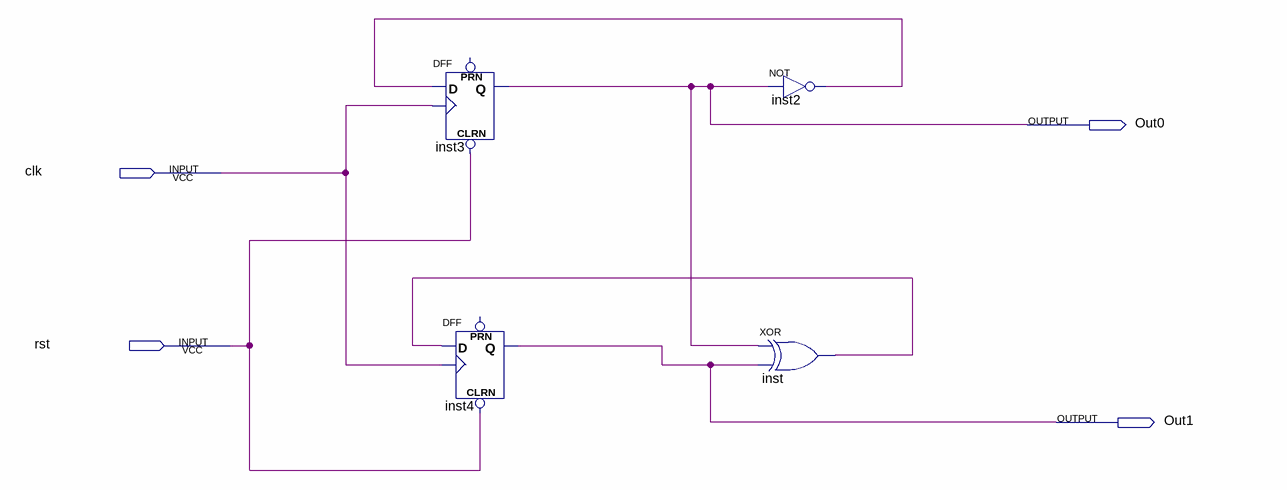
[diagram p0: schematic sheet]
// Quartus schematic counter4.bdf as structural Verilog: 4 symbols, 4 pins
module counter4 (
  input  clk,
  input  rst,
  output Out0,
  output Out1
);

  wire inst2_out, inst_out;

  DFF inst3 (.CLRN(rst), .CLK(clk), .D(inst2_out), .Q(Out0));  // open: PRN
  DFF inst4 (.CLRN(rst), .CLK(clk), .D(inst_out), .Q(Out1));  // open: PRN
  not inst2 (inst2_out, Out0);
  xor inst (inst_out, Out0, Out1);
endmodule
